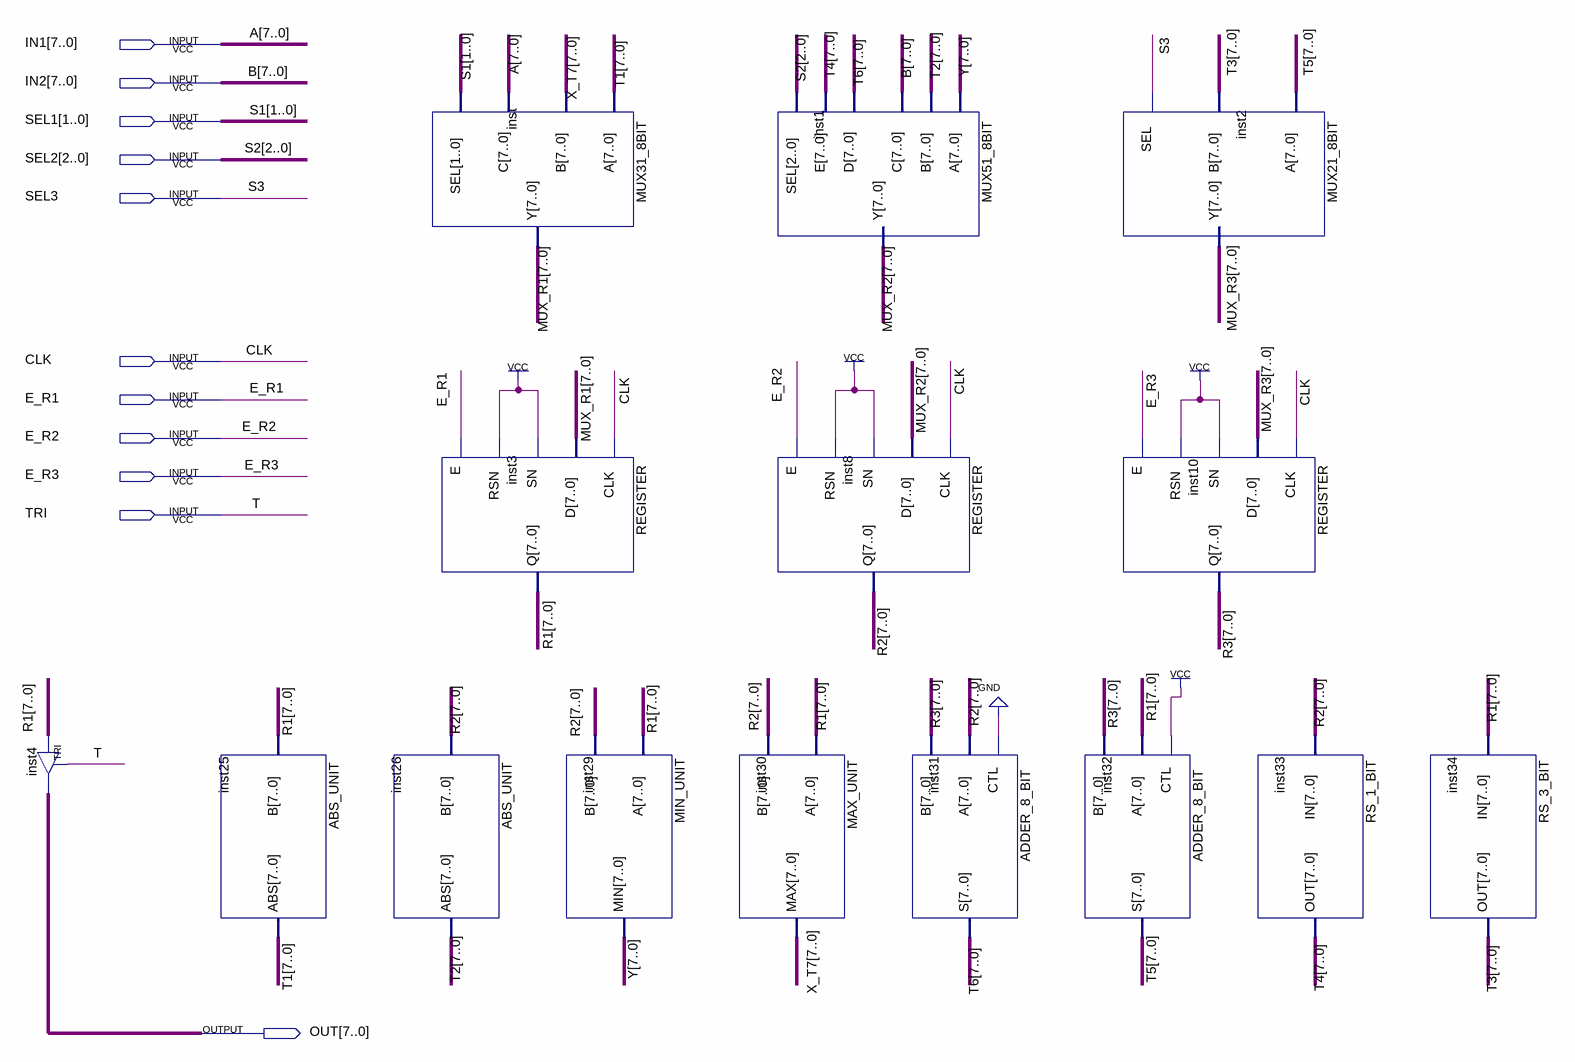
[diagram p0: schematic sheet]
// Quartus schematic Register_Sharing_DATAPATH.bdf as structural Verilog: 15 symbols, 11 pins
module Register_Sharing_DATAPATH (
  input  [7:0] IN1,
  input  [7:0] IN2,
  input  [1:0] SEL1,
  input  [2:0] SEL2,
  input  SEL3,
  input  CLK,
  input  E_R1,
  input  E_R2,
  input  E_R3,
  input  TRI,
  output [7:0] OUT
);

  wire [7:0] MUX_R1, MUX_R2, MUX_R3, R1, R2, R3, T1, T2, T3, T4, T5, T6, X_T7, Y;

  TRI inst4[7:0] (.IN(R1), .OE(TRI), .OUT(OUT));
  ABS_UNIT inst25 (.B(R1), .ABS(T1));
  ABS_UNIT inst26 (.B(R2), .ABS(T2));
  MUX31_8BIT inst (.A(T1), .C(IN1), .B(X_T7), .SEL(SEL1), .Y(MUX_R1));
  REGISTER inst3 (.CLK(CLK), .D(MUX_R1), .SN(1'b1), .RSN(1'b1), .E(E_R1), .Q(R1));
  MIN_UNIT inst29 (.A(R1), .B(R2), .MIN(Y));
  MUX51_8BIT inst1 (.A(Y), .B(T2), .C(IN2), .D(T6), .E(T4), .SEL(SEL2), .Y(MUX_R2));
  REGISTER inst8 (.CLK(CLK), .D(MUX_R2), .SN(1'b1), .RSN(1'b1), .E(E_R2), .Q(R2));
  MAX_UNIT inst30 (.A(R1), .B(R2), .MAX(X_T7));
  ADDER_8_BIT inst31 (.CTL(1'b0), .A(R2), .B(R3), .S(T6));
  ADDER_8_BIT inst32 (.CTL(1'b1), .A(R1), .B(R3), .S(T5));
  MUX21_8BIT inst2 (.A(T5), .B(T3), .SEL(SEL3), .Y(MUX_R3));
  REGISTER inst10 (.CLK(CLK), .D(MUX_R3), .SN(1'b1), .RSN(1'b1), .E(E_R3), .Q(R3));
  RS_1_BIT inst33 (.IN(R2), .OUT(T4));
  RS_3_BIT inst34 (.IN(R1), .OUT(T3));

  // Other names for the same wires on the sheet: A[7:0] = IN1; B[7:0] = IN2; S1[1:0] = SEL1; S2[2:0] = SEL2;
  //   S3 = SEL3; T = TRI
endmodule
